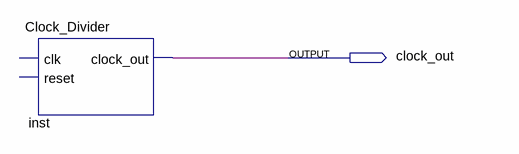
[diagram p0: schematic sheet]
// Quartus schematic TEST.bdf as structural Verilog: 1 symbols, 1 pins
module TEST (
  output clock_out
);

  Clock_Divider inst (.clock_out(clock_out));  // open: clk, reset
endmodule
